# Altium schematic sheet VESC_KS75600_motor_mcu.SchDoc
size A3; SheetNumber: 3; SheetTotal: 4
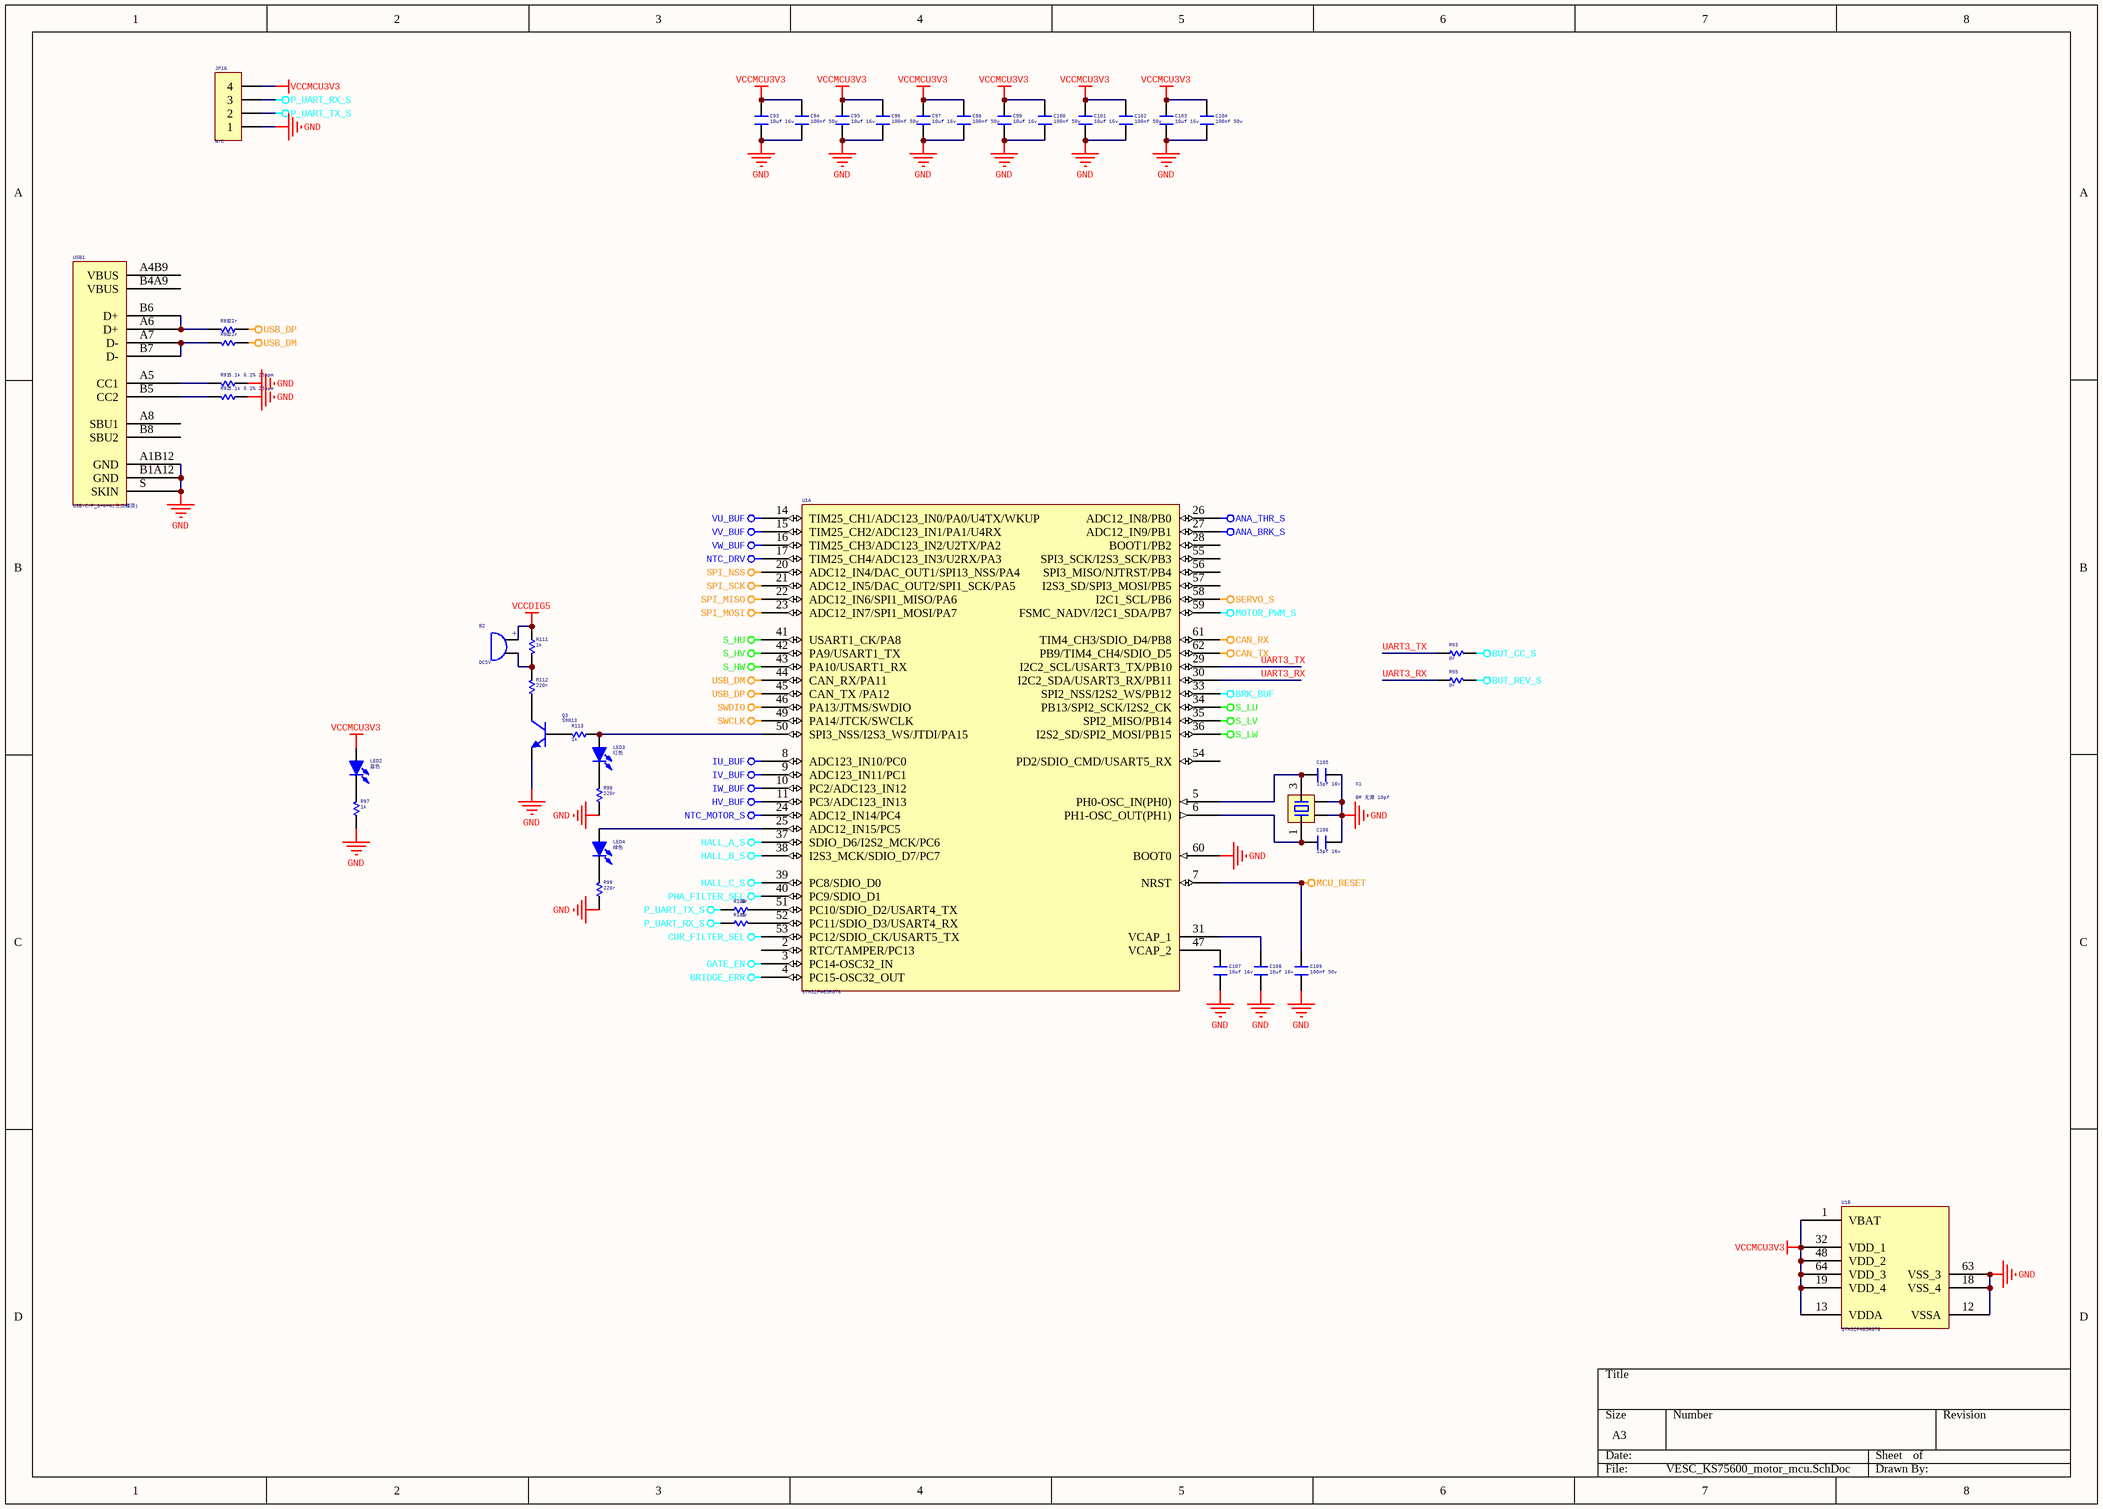
[diagram p0: VESC_KS75600_motor_mcu.SchDoc]

## Parts
B2  DC5V  [BEEP 5x9x5.5]
C93  10uf 16v  [C 0805]
C94  100nf 50v  [C 0603]
C95  10uf 16v  [C 0805]
C96  100nf 50v  [C 0603]
C97  10uf 16v  [C 0805]
C98  100nf 50v  [C 0603]
C99  10uf 16v  [C 0805]
C100  100nf 50v  [C 0603]
C101  10uf 16v  [C 0805]
C102  100nf 50v  [C 0603]
C103  10uf 16v  [C 0805]
C104  100nf 50v  [C 0603]
C105  15pf 16v  [C 0603]
C106  15pf 16v  [C 0603]
C107  10uf 16v  [C 0805]
C108  10uf 16v  [C 0805]
C109  100nf 50v  [C 0603]
JP16  N/C  [HDR-1X4]
LED2  蓝色  [LED 0603G]
LED3  红色  [LED 0603G]
LED4  绿色  [LED 0603G]
Q3  S9013  [SOT23-3N]
R89  22r  [R 0603]
R90  22r  [R 0603]
R91  5.1k 0.1% 25ppm  [R 0805-HP]
R92  5.1k 0.1% 25ppm  [R 0805-HP]
R93  0r  [R 0603]
R95  0r  [R 0603]
R97  1k  [R 0603]
R98  220r  [R 0603]
R99  220r  [R 0603]
R100  0r  [R 0603]
R101  0r  [R 0603]
R111  1k  [R 0603]
R112  220r  [R 0603]
R113  1k  [R 0603]
U1  STM32F405RGT6  [LQFP64 10x10_L]  (parts A,B of 2)
USB1  USB-C/P_8+4+4(三次模顶)  [USB-C/S_16_0D_F]
X1  8M 无源 10pf  [XTAL-3225]

## Nets
ANA_BRK_S: U1.27(ADC12_IN9/PB1)
ANA_THR_S: U1.26(ADC12_IN8/PB0)
BRIDGE_ERR: U1.4(PC15-OSC32_OUT)
BRK_BUF: U1.33(SPI2_NSS/I2S2_WS/PB12)
BUT_CC_S: R93.2
BUT_REV_S: R95.2
CAN_RX: U1.61(TIM4_CH3/SDIO_D4/PB8)
CAN_TX: U1.62(PB9/TIM4_CH4/SDIO_D5)
CUR_FILTER_SEL: U1.53(PC12/SDIO_CK/USART5_TX)
GATE_EN: U1.3(PC14-OSC32_IN)
GND: C93.2 C94.2 C95.2 C96.2 C97.2 C98.2 C99.2 C100.2 C101.2 C102.2 C103.2 C104.2 C105.1 C106.1 C107.2 C108.2 C109.1 JP16.1 Q3.2(E) R91.1 R92.1 R97.1 R98.1 R99.1 U1.12(VSSA) U1.18(VSS_4) U1.60(BOOT0) U1.63(VSS_3) USB1.A1B12(GND) USB1.B1A12(GND) USB1.S(SKIN) X1.2 X1.4
HALL_A_S: U1.37(SDIO_D6/I2S2_MCK/PC6)
HALL_B_S: U1.38(I2S3_MCK/SDIO_D7/PC7)
HALL_C_S: U1.39(PC8/SDIO_D0)
HV_BUF: U1.11(PC3/ADC123_IN13)
IU_BUF: U1.8(ADC123_IN10/PC0)
IV_BUF: U1.9(ADC123_IN11/PC1)
IW_BUF: U1.10(PC2/ADC123_IN12)
MCU_RESET: C109.2 U1.7(NRST)
MOTOR_PWM_S: U1.59(FSMC_NADV/I2C1_SDA/PB7)
NTC_DRV: U1.17(TIM25_CH4/ADC123_IN3/U2RX/PA3)
NTC_MOTOR_S: U1.24(ADC12_IN14/PC4)
P_UART_RX_S: JP16.3 R101.1
P_UART_TX_S: JP16.2 R100.1
PHA_FILTER_SEL: U1.40(PC9/SDIO_D1)
S_HU: U1.41(USART1_CK/PA8)
S_HV: U1.42(PA9/USART1_TX)
S_HW: U1.43(PA10/USART1_RX)
S_LU: U1.34(PB13/SPI2_SCK/I2S2_CK)
S_LV: U1.35(SPI2_MISO/PB14)
S_LW: U1.36(I2S2_SD/SPI2_MOSI/PB15)
SERVO_S: U1.58(I2C1_SCL/PB6)
SPI_MISO: U1.22(ADC12_IN6/SPI1_MISO/PA6)
SPI_MOSI: U1.23(ADC12_IN7/SPI1_MOSI/PA7)
SPI_NSS: U1.20(ADC12_IN4/DAC_OUT1/SPI13_NSS/PA4)
SPI_SCK: U1.21(ADC12_IN5/DAC_OUT2/SPI1_SCK/PA5)
SWCLK: U1.49(PA14/JTCK/SWCLK)
SWDIO: U1.46(PA13/JTMS/SWDIO)
USB_DM: R90.1 U1.44(CAN_RX/PA11)
USB_DP: R89.1 U1.45(CAN_TX_/PA12)
VCCDIG5: B2.1 R111.1
VCCMCU3V3: C93.1 C94.1 C95.1 C96.1 C97.1 C98.1 C99.1 C100.1 C101.1 C102.1 C103.1 C104.1 JP16.4 LED2.1(A) U1.1(VBAT) U1.13(VDDA) U1.19(VDD_4) U1.32(VDD_1) U1.48(VDD_2) U1.64(VDD_3)
VU_BUF: U1.14(TIM25_CH1/ADC123_IN0/PA0/U4TX/WKUP)
VV_BUF: U1.15(TIM25_CH2/ADC123_IN1/PA1/U4RX)
VW_BUF: U1.16(TIM25_CH3/ADC123_IN2/U2TX/PA2)
UART3_RX: R95.1 U1.30(I2C2_SDA/USART3_RX/PB11)
UART3_TX: R93.1 U1.29(I2C2_SCL/USART3_TX/PB10)
NetB2_2: B2.2 R111.2 R112.2
NetC105_2: C105.2 U1.5(PH0-OSC_IN(PH0)) X1.3
NetC106_2: C106.2 U1.6(PH1-OSC_OUT(PH1)) X1.1
NetC107_1: C107.1 U1.47(VCAP_2)
NetC108_1: C108.1 U1.31(VCAP_1)
NetLED2_2: LED2.2(K) R97.2
NetLED3_1: LED3.1(A) R113.1 U1.50(SPI3_NSS/I2S3_WS/JTDI/PA15)
NetLED3_2: LED3.2(K) R98.2
NetLED4_1: LED4.1(A) U1.25(ADC12_IN15/PC5)
NetLED4_2: LED4.2(K) R99.2
NetQ3_1: Q3.1(B) R113.2
NetQ3_3: Q3.3(C) R112.1
NetR89_2: R89.2 USB1.A6(D+) USB1.B6(D+)
NetR90_2: R90.2 USB1.A7(D-) USB1.B7(D-)
NetR91_2: R91.2 USB1.A5(CC1)
NetR92_2: R92.2 USB1.B5(CC2)
NetR100_2: R100.2 U1.51(PC10/SDIO_D2/USART4_TX)
NetR101_2: R101.2 U1.52(PC11/SDIO_D3/USART4_RX)

Not connected (* = marked no-connect by the designer): U1 2(RTC/TAMPER/PC13) 28(BOOT1/PB2) 54(PD2/SDIO_CMD/USART5_RX) 55(SPI3_SCK/I2S3_SCK/PB3) 56(SPI3_MISO/NJTRST/PB4) 57(I2S3_SD/SPI3_MOSI/PB5); USB1 A4B9(VBUS) A8(SBU1) B4A9(VBUS) B8(SBU2)

## Notes on the sheet
- (in symbol BEEP) +

## Library data of the parts
B2 = BEEP: 蜂鸣器
C93-C109 = C: 无极性贴片电容
  C93 C95 C97 C99 C101 C103 C107 C108: Voltage: 16v; Value: 10uf
  C94 C96 C98 C100 C102 C104 C109: Voltage: 50v; Value: 100nf
  C105 C106: Voltage: 16v; Value: 15pf
JP16 = Header 4: 4P接插件
LED2-LED4 = LED-SMD: 贴片LED
Q3 = 9013-SMD: 低频放大-NPN型
R89-R93 R95 R97-R101 R111-R113 = R: 贴片电阻
  R89 R90: Value: 22r
  R91 R92: Value: 5.1k 0.1% 25ppm
  R93 R95 R100 R101: Value: 0r
  R97 R111 R113: Value: 1k
  R98 R99 R112: Value: 220r
U1 = STM32F405RG: Flash:1024/RAM:192/IO:51
USB1 = USB-C/P_8+4+4: USB-C型贴片母接口 8（8线）+4 (电源) + 4（外壳）（2.0基础数据+CC+SBU）
X1 = XTAL-4: 4脚晶振